# EAGLE design bodo09 (EAGLE 7.3.0)
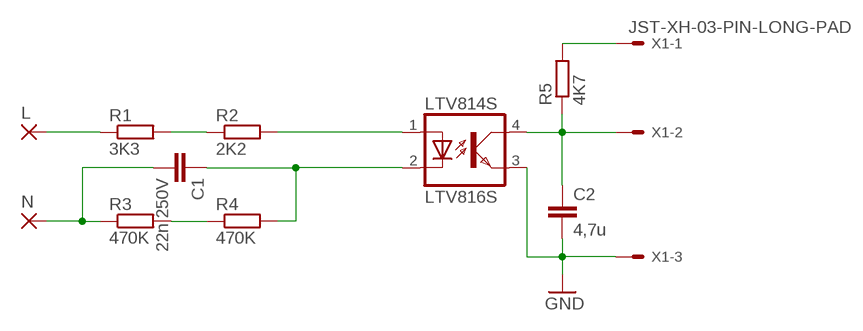
[diagram p0: schematic, sheet 1]

## Parts
C1  22n 250V  C-EUC2220K  [C2220K]
C2  4,7u  C-EUC1206K  [C1206K]
L  3,81/1,4  [3,81/1,4]
LTV814S  LTV816S  [SMD4]
N  3,81/1,4  [3,81/1,4]
R1  3K3  R-EU_R1206  [R1206]
R2  2K2  R-EU_R1206  [R1206]
R3  470K  R-EU_R1206  [R1206]
R4  470K  R-EU_R1206  [R1206]
R5  4K7  R-EU_R0805  [R0805]
X1  JST-XH-03-PIN-LONG-PAD  [JST-XH-03-PACKAGE-LONG-PAD]

## Nets
GND [LV]: C2.2 LTV814S.3(EMIT) X1.3
N$1: L.1(P) R1.1
N$2: C1.2 N.1(P) R3.1
N$3: R3.2 R4.1
N$4: C1.1 LTV814S.2(C) R4.2
N$5: LTV814S.1(A) R2.2
N$6: R1.2 R2.1
N$7 [LV]: C2.1 LTV814S.4(COL) R5.1 X1.2
N$8 [LV]: R5.2 X1.1

## Library data of the parts
C1 C2 = rcl:C-EU: CAPACITOR, European symbol
L N = wirepad:3,81/1,4: THROUGH-HOLE PAD
LTV814S = optocoupler-3-jcn:LTV816: OPTO COUPLER Source: LITEON, LTV816.pdf
R1-R5 = rcl:R-EU_: RESISTOR, European symbol
X1 = Rembrandt Electronics - JST XH Connectors v1-0:JST-XH-03-PIN: JST XH Connector 2 Pin Wire to board connector. Pitch: 2,54 mm, (0.100") Number of pins: 3 Created by Rembrandt Electronics www.rembrandtelectronics.com

## Net classes
0 default: width 0.457 mm, clearance 0.356 mm
1 LV: width 0.406 mm, clearance 0.203 mm

## Board
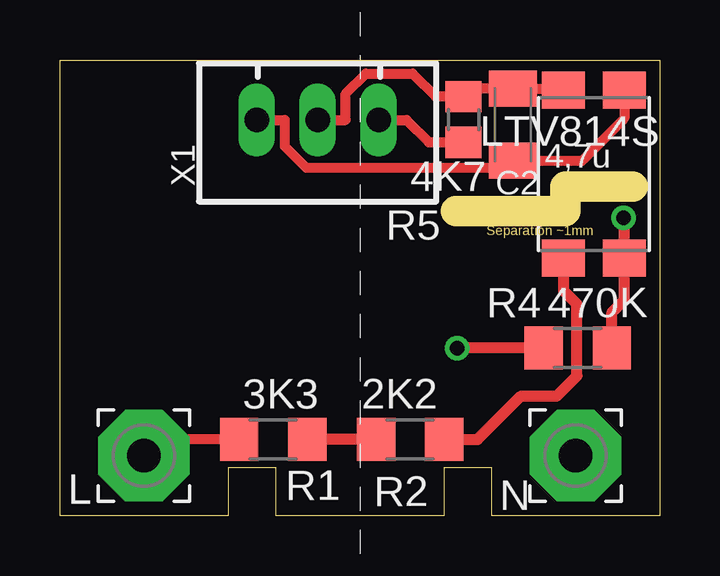
[diagram p1: board, top side]
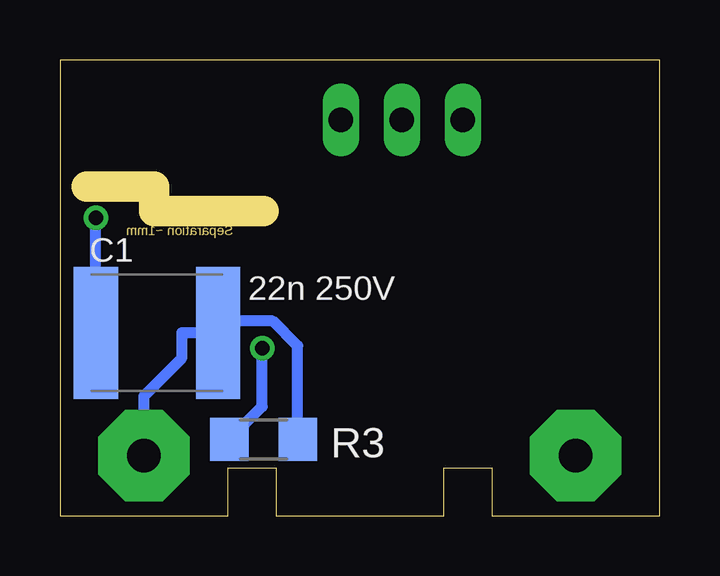
[diagram p2: board, bottom side, seen from below]

Size 25 x 19 mm. Coordinates in mm from the lower left corner, seen from the top.
Outline: 0,0 0,19 25,19 25,0 18,0 18,2 16,2 16,0 9,0 9,2 7,2 7,0 0,0
Copper layers (1*16): Top 0.035mm / dielectric 1.5mm / Bottom 0.035mm
Design rules "default": minimum track width 10mil, minimum drill 24mil, track to track 8mil, track to pad 8mil, pad to pad 8mil, via to via 8mil, smd to smd 8mil, copper to edge 40mil, drill to drill 8mil, minimum pad ring 10mil, minimum via ring 8mil, stop-mask expansion 4mil, vias tented up to drill 0mil, thermal gap 10mil
tRestrict: area 1,6.1 to 18.8,13.5
bRestrict: area 1,6.1 to 18.8,13.5
Milling: 3 lines

### Footprints (pad centres in the part's own frame; a part is rotated, then mirrored left to right if it is on the bottom)
C2220K = smd 1.85 x 5.5: 1 -2.55,0; 2 2.55,0
C1206K = smd 1.5 x 2: 1 -1.5,0; 2 1.5,0
3,81/1,4 = drill 1.397 pad 3.81 octagon: 1 0,0
SMD4 = smd 1.78 x 1.55: 1 -1.27,-3.5; 2 1.27,-3.5; 3 1.27,3.5; 4 -1.27,3.5
R1206 = smd 1.6 x 1.803: 1 -1.422,0; 2 1.422,0
R0805 = smd 1.3 x 1.5: 1 -0.95,0; 2 0.95,0
JST-XH-03-PACKAGE-LONG-PAD = drill 1.016 long: 1 -2.54,0; 2 0,0; 3 2.54,0

### Placement (x,y rotation side)
C1  20.95,7.62 0 bottom
C2  18.88,16.3 270 top
L  3.5,2.5 0 top
LTV814S  22.26,14.24 0 top
N  21.5,2.5 0 top
R1  8.89,3.17 0 top
R2  14.61,3.17 0 top
R3  16.51,3.17 180 bottom
R4  21.59,6.99 0 top
R5  16.83,16.51 270 top
X1  10.75,16.49 180 top

### Tracks (layer width: path | path; a pad name or v marks a point on that pad's centre or on a via)
GND
  Top 0.406: LTV814S.3 23.53,16.56 21.77,14.8 C2.2 18.59,14.51 10.26,14.51 9.37,15.4 9.37,16.49 X1.3
N$1
  Top 0.406: R1.1 3.5,3.17 L.1
N$2
  Bottom 0.457: N.1 21.5,4.99 19.91,6.58 19.91,7.62 C1.2 17.92,8.11 16.12,8.11 15.09,7.08 R3.1
N$3  (via drill 0.61 pad 1.02)
  Top 0.457: R4.1 v16.56,6.99
  Bottom 0.457: R3.2 16.56,4.54 v16.56,6.99
N$4  (via drill 0.61 pad 1.02)
  Top 0.457: v23.5,12.42 23.5,12.12 23.53,12.1 LTV814S.2 23.53,8.99 23.01,8.47 R4.2
  Bottom 0.457: C1.1 v23.5,12.42
N$5
  Top 0.457: LTV814S.1 20.99,9.38 21.55,8.82 21.55,5.83 20.71,4.99 19.23,4.99 17.41,3.17 R2.2
N$6
  Top 0.457: R2.1 R1.2
N$7
  Top 0.406: X1.2 11.91,16.49 11.91,17.59 12.76,18.43 14.7,18.43 15.67,17.46 R5.1 17.14,17.46 17.47,17.8 C2.1 20.29,17.8 20.35,17.74 LTV814S.4
N$8
  Top 0.406: X1.1 14.45,16.49 15.38,15.56 R5.2

### Text on the board
Milling: Separation ~1mm